# EAGLE schematic Xiao-SCD41-SSD1306 (EAGLE 9.6.0)
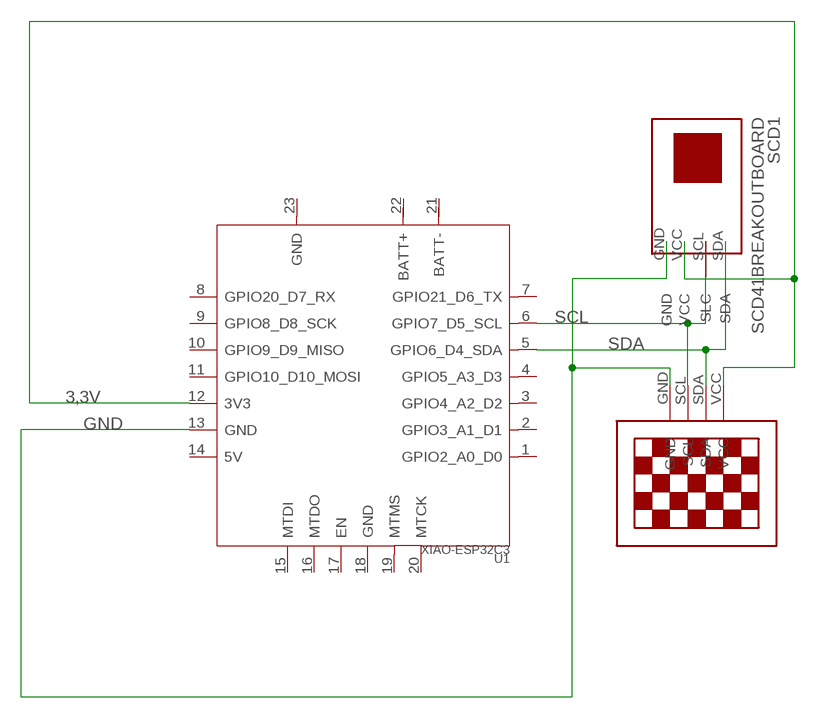
[diagram p0: schematic, sheet 1]

## Parts
SCD1  SCD41BREAKOUTBOARD  [SCD41]
U1  XIAO-ESP32C3  [XIAO-ESP32C3-MODULE14P-2.54-21X17.8MM]
U$1  13"OLED13"OLED  [1.3"OLED]

## Nets
3,3V: SCD1.VCC U1.12(3V3) U$1.VCC
GND: SCD1.GND U1.13(GND) U$1.GND
SCL: SCD1.SCL(SLC) U1.6(GPIO7_D5_SCL) U$1.SCL
SDA: SCD1.SDA U1.5(GPIO6_D4_SDA) U$1.SDA
Unconnected: U1.1(GPIO2_A0_D0) U1.2(GPIO3_A1_D1) U1.3(GPIO4_A2_D2) U1.4(GPIO5_A3_D3) U1.7(GPIO21_D6_TX) U1.8(GPIO20_D7_RX) U1.9(GPIO8_D8_SCK) U1.10(GPIO9_D9_MISO) U1.11(GPIO10_D10_MOSI) U1.14(5V) U1.15(MTDI) U1.16(MTDO) U1.17(EN) U1.18(GND) U1.19(MTMS) U1.20(MTCK) U1.21(BATT-) U1.22(BATT+) U1.23(GND)

## Library data of the parts
SCD1 = MYlib:SCD41BREAKOUTBOARD: The SCD4x is Sensirion’s second generation optical CO2 sensor. This sensor builds on the photoacoustic NDIR sensing principle and Sensirion’s patented PASens® and CMOSens® technology to offer high accuracy at an attractive price and small form factor. SMD assembly allows cost- and space-effective integration of the sensor combined with maximal freedom of design. On-chip signal compensation is realized with the built-in SHT4x humidity and temperature sensor. CO2 is a key indicator for indoor air quality (IAQ), as high levels compromise human cognitive performance and well-being. The SCD4x enables smart ventilation regulation to help improve energy efficiency and human comfort. Moreover, indoor air quality monitors and other connected devices based on the SCD4x can help maintain low CO2 concentrations for a healthy, productive environment. SCD41-D-R2 High accuracy, specified range 400 – 5’000 ppm, compatible with common IAQ/building standards, single shot operation feature
U1 = Seeed Studio XIAO Series:XIAO-ESP32C3: Seeed Studio XIAO ESP32C3 - Espressif ESP32-C3 WiFi BLE Microcontroller - 32-bit 160MHz RISC-V processor Seeed SKU: 113991054 Seeed Studio XIAO ESP32C3 featuring ESP32C3 carries a complete Wi-Fi system along with Bluetooth Low Energy function. With its exquisite design, WiFi+BT ability, it's perfect for various IoT controlling scenarios and complex carriable applications. Buy now <https://www.seeedstudio.com/Seeed-XIAO-ESP32C3-p-5431.html> Wiki <https://wiki.seeedstudio.com/XIAO_ESP32C3_Getting_Started/>
U$1 = 13oled:13"OLED